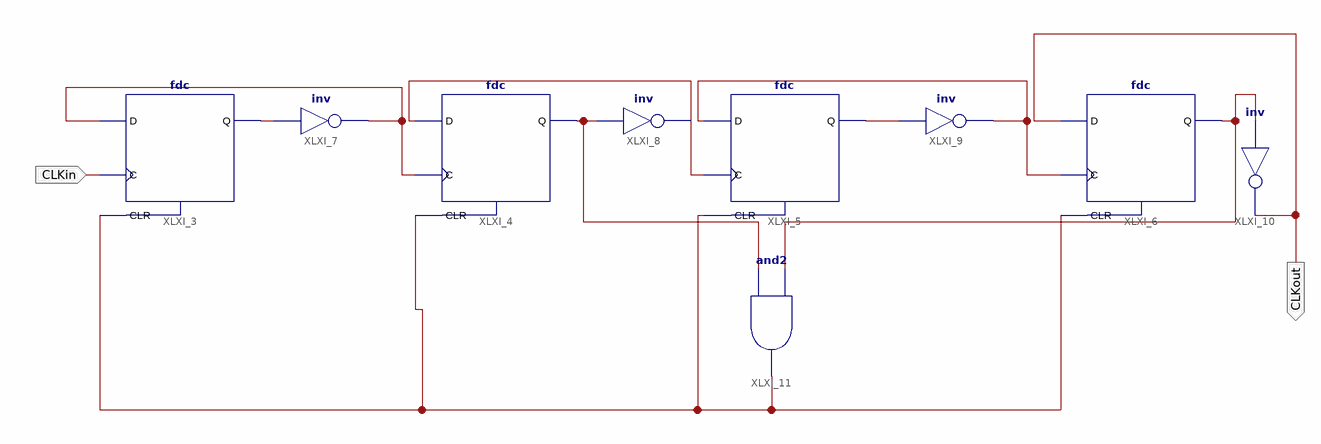
[diagram p0: schematic sheet 1]
// Xilinx ISE schematic Div10V2.sch (spartan6) as structural Verilog: 9 symbols, 2 ports
module Div10V2 (
  input  CLKin,
  output CLKout
);

  wire XLXN_1, XLXN_3, XLXN_6, XLXN_9, XLXN_11, XLXN_12, XLXN_13, XLXN_18;

  fdc XLXI_3 (.C(CLKin), .CLR(XLXN_18), .D(XLXN_9), .Q(XLXN_1));
  fdc XLXI_4 (.C(XLXN_9), .CLR(XLXN_18), .D(XLXN_11), .Q(XLXN_3));
  fdc XLXI_5 (.C(XLXN_11), .CLR(XLXN_18), .D(XLXN_12), .Q(XLXN_6));
  fdc XLXI_6 (.C(XLXN_12), .CLR(XLXN_18), .D(CLKout), .Q(XLXN_13));
  not XLXI_7 (XLXN_9, XLXN_1);
  not XLXI_8 (XLXN_11, XLXN_3);
  not XLXI_9 (XLXN_12, XLXN_6);
  not XLXI_10 (CLKout, XLXN_13);
  and XLXI_11 (XLXN_18, XLXN_3, XLXN_13);
endmodule
